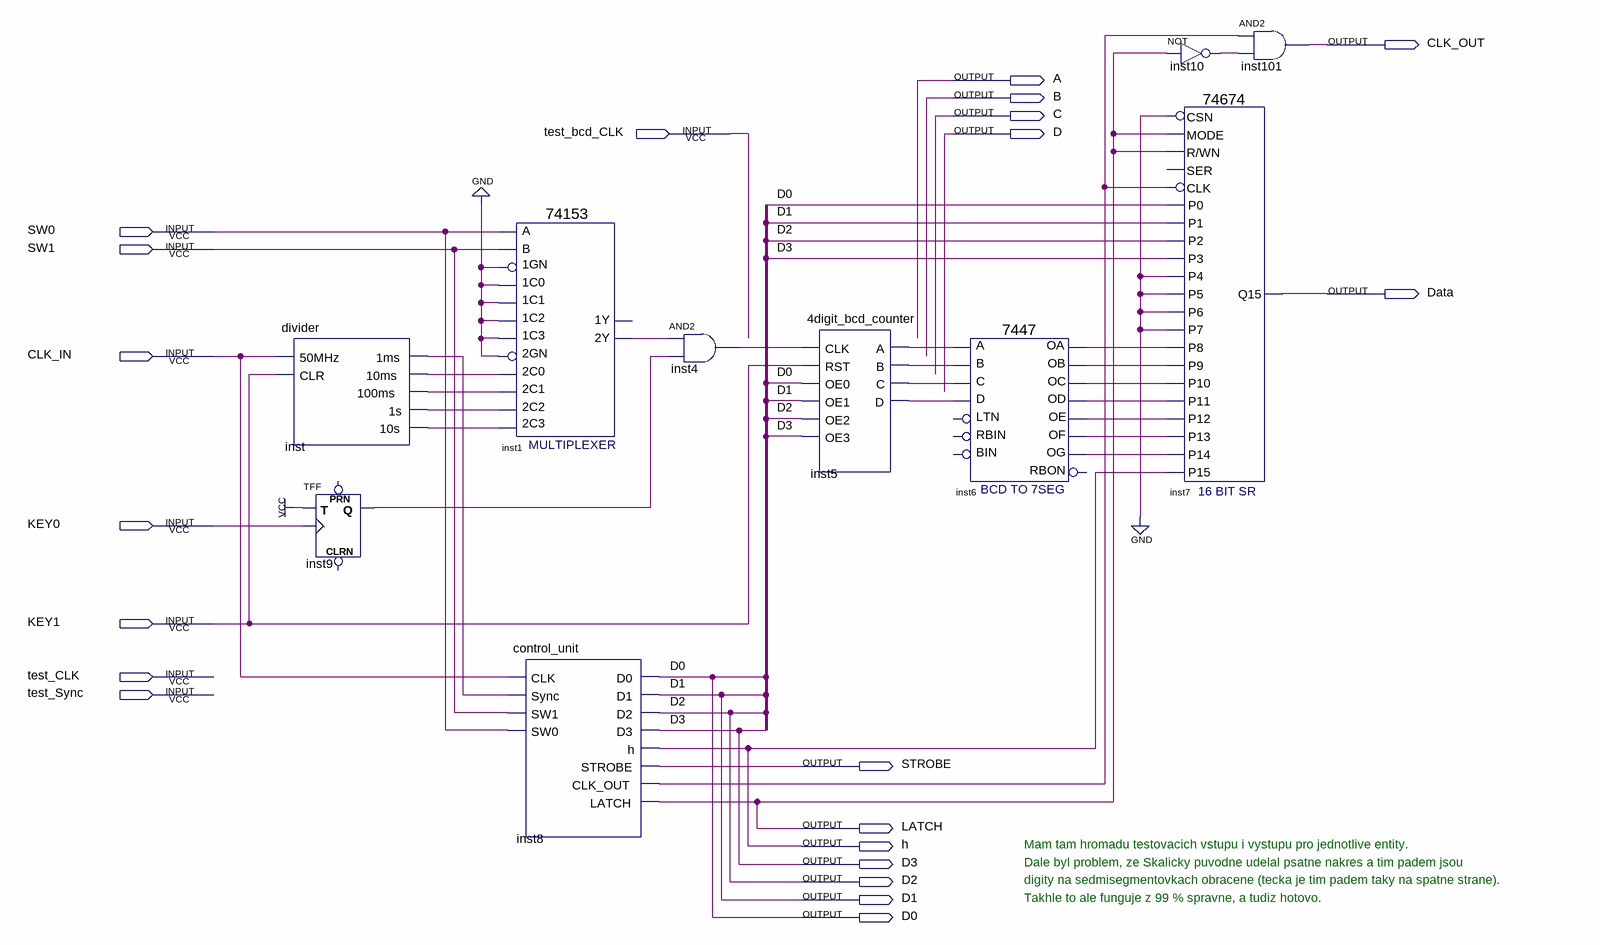
[diagram p0: schematic sheet]
// Quartus schematic hw02_simakma5.bdf as structural Verilog: 10 symbols, 21 pins
module hw02_simakma5 (
  input  test_bcd_CLK,
  input  SW0,
  input  SW1,
  input  CLK_IN,
  input  KEY0,
  input  KEY1,
  input  test_CLK,
  input  test_Sync,
  output CLK_OUT,
  output A,
  output B,
  output C,
  output D,
  output Data,
  output STROBE,
  output LATCH,
  output h,
  output D3,
  output D2,
  output D1,
  output D0
);

  wire inst1_2y, inst4_out, inst5_a, inst5_b, inst5_c, inst5_d, inst6_oa, inst6_ob, inst6_oc, inst6_od,
       inst6_oe, inst6_of, inst6_og, inst8_clk_out, inst9_q, inst10_out, inst_1ms, inst_1s, inst_10ms,
       inst_10s, inst_100ms;

  divider inst (
    .\50MHz (CLK_IN), .CLR(KEY1), .\1ms (inst_1ms), .\10ms (inst_10ms), .\100ms (inst_100ms), .\1s (inst_1s),
    .\10s (inst_10s));
  TFF inst9 (.T(1'b1), .CLK(KEY0), .Q(inst9_q));  // open: PRN, CLRN
  \74153  inst1 (
    .\1C1 (1'b0), .\1GN (1'b0), .\1C0 (1'b0), .\2C0 (inst_10ms), .\2GN (1'b0), .\2C2 (inst_1s), .\1C2 (1'b0),
    .\1C3 (1'b0), .B(SW1), .A(SW0), .\2C1 (inst_100ms), .\2C3 (inst_10s), .\2Y (inst1_2y));  // open: 1Y
  control_unit inst8 (
    .CLK(CLK_IN), .Sync(inst_1ms), .SW1(SW1), .SW0(SW0), .D0(D0), .D1(D1), .D2(D2), .D3(D3), .h(h),
    .STROBE(STROBE), .CLK_OUT(inst8_clk_out), .LATCH(LATCH));
  and inst4 (inst4_out, inst1_2y, inst9_q);
  \4digit_bcd_counter  inst5 (
    .CLK(inst4_out), .RST(KEY1), .OE0(D0), .OE1(D1), .OE2(D2), .OE3(D3), .A(inst5_a), .B(inst5_b),
    .C(inst5_c), .D(inst5_d));
  \7447  inst6 (
    .B(inst5_b), .C(inst5_c), .D(inst5_d), .A(inst5_a), .OB(inst6_ob), .OC(inst6_oc), .OE(inst6_oe),
    .OD(inst6_od), .OF(inst6_of), .OG(inst6_og), .OA(inst6_oa));  // open: LTN, RBIN, BIN, RBON
  not inst10 (inst10_out, LATCH);
  \74674  inst7 (
    .P0(D0), .P1(D1), .P2(D2), .P3(D3), .P5(1'b0), .P4(1'b0), .P6(1'b0), .P7(1'b0), .P10(inst6_oc),
    .P9(inst6_ob), .P8(inst6_oa), .P13(inst6_of), .P12(inst6_oe), .P11(inst6_od), .CSN(1'b0), .P15(h),
    .P14(inst6_og), .\R/WN (LATCH), .CLK(inst8_clk_out), .MODE(LATCH), .Q15(Data));  // open: SER
  and inst101 (CLK_OUT, inst8_clk_out, inst10_out);

  // Notes on the sheet:
  //   Mam tam hromadu testovacich vstupu i vystupu pro jednotlive entity.
  //   Dale byl problem, ze Skalicky puvodne udelal psatne nakres a tim padem jsou
  //   digity na sedmisegmentovkach obracene (tecka je tim padem taky na spatne strane).
  //   Takhle to ale funguje z 99 % spravne, a tudiz hotovo.
endmodule
